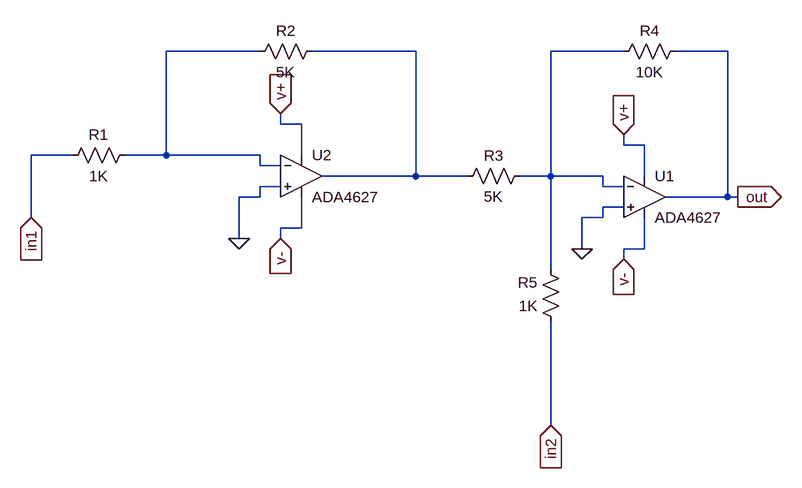
[diagram p0: schematic Draft1.asc]
Draft1.asc, the LTspice schematic file:
Version 4
SHEET 1 880 680
WIRE -224 -144 -368 -144
WIRE 16 -144 -144 -144
WIRE 336 -144 224 -144
WIRE 496 -144 416 -144
WIRE -192 -32 -192 -48
WIRE -160 -32 -192 -32
WIRE 336 0 336 -16
WIRE 368 0 336 0
WIRE -512 16 -576 16
WIRE -368 16 -368 -144
WIRE -368 16 -432 16
WIRE -224 16 -368 16
WIRE -160 16 -160 -32
WIRE -224 32 -224 16
WIRE -192 32 -224 32
WIRE 16 48 16 -144
WIRE 16 48 -128 48
WIRE 96 48 16 48
WIRE 224 48 224 -144
WIRE 224 48 176 48
WIRE 304 48 224 48
WIRE 368 48 368 0
WIRE -192 64 -224 64
WIRE 304 64 304 48
WIRE 336 64 304 64
WIRE -224 80 -224 64
WIRE -224 80 -256 80
WIRE 496 80 496 -144
WIRE 496 80 400 80
WIRE 512 80 496 80
WIRE 336 96 304 96
WIRE -576 112 -576 16
WIRE 304 112 304 96
WIRE 304 112 272 112
WIRE -160 128 -160 80
WIRE -160 128 -192 128
WIRE -256 144 -256 80
WIRE -192 144 -192 128
WIRE 272 160 272 112
WIRE 368 160 368 112
WIRE 368 160 336 160
WIRE 336 176 336 160
WIRE 224 192 224 48
WIRE 224 432 224 272
FLAG -256 144 0
FLAG 272 160 0
FLAG -576 112 in1
IOPIN -576 112 In
FLAG 224 432 in2
IOPIN 224 432 In
FLAG -192 -48 v+
IOPIN -192 -48 In
FLAG 336 -16 v+
IOPIN 336 -16 In
FLAG -192 144 v-
IOPIN -192 144 In
FLAG 336 176 v-
IOPIN 336 176 In
FLAG 512 80 out
IOPIN 512 80 Out
SYMBOL res -416 0 R90
WINDOW 0 0 56 VBottom 2
WINDOW 3 32 56 VTop 2
SYMATTR InstName R1
SYMATTR Value 1K
SYMBOL res -128 -160 R90
WINDOW 0 0 56 VBottom 2
WINDOW 3 32 56 VTop 2
SYMATTR InstName R2
SYMATTR Value 5K
SYMBOL res 192 32 R90
WINDOW 0 0 56 VBottom 2
WINDOW 3 32 56 VTop 2
SYMATTR InstName R3
SYMATTR Value 5K
SYMBOL res 432 -160 R90
WINDOW 0 0 56 VBottom 2
WINDOW 3 32 56 VTop 2
SYMATTR InstName R4
SYMATTR Value 10K
SYMBOL res 240 288 R180
WINDOW 0 36 76 Left 2
WINDOW 3 36 40 Left 2
SYMATTR InstName R5
SYMATTR Value 1K
SYMBOL OpAmps\\ADA4627 368 16 R0
SYMATTR InstName U1
SYMBOL OpAmps\\ADA4627 -160 -16 R0
SYMATTR InstName U2

The netlist it stands for:
* Draft1.asc
R1 N001 in1 1K
R2 N002 N001 5K
R3 N003 N002 5K
R4 out N003 10K
R5 in2 N003 1K
XU1 0 N003 v+ v- out ADA4627  ; pins In+ In- V+ V- OUT
XU2 0 N001 v+ v- N002 ADA4627  ; pins In+ In- V+ V- OUT
.backanno
.end